# Altium schematic sheet Spindle_Sync.SchDoc: STM32F446 CNC
size B; Author: AM; CompanyName: Expatria Technologies; DrawnBy: A.Marles; Engineer: AM; Organization: Expatria Technolgoies; DocumentNumber: 11; Revision: A1; SheetNumber: 11; SheetTotal: 14
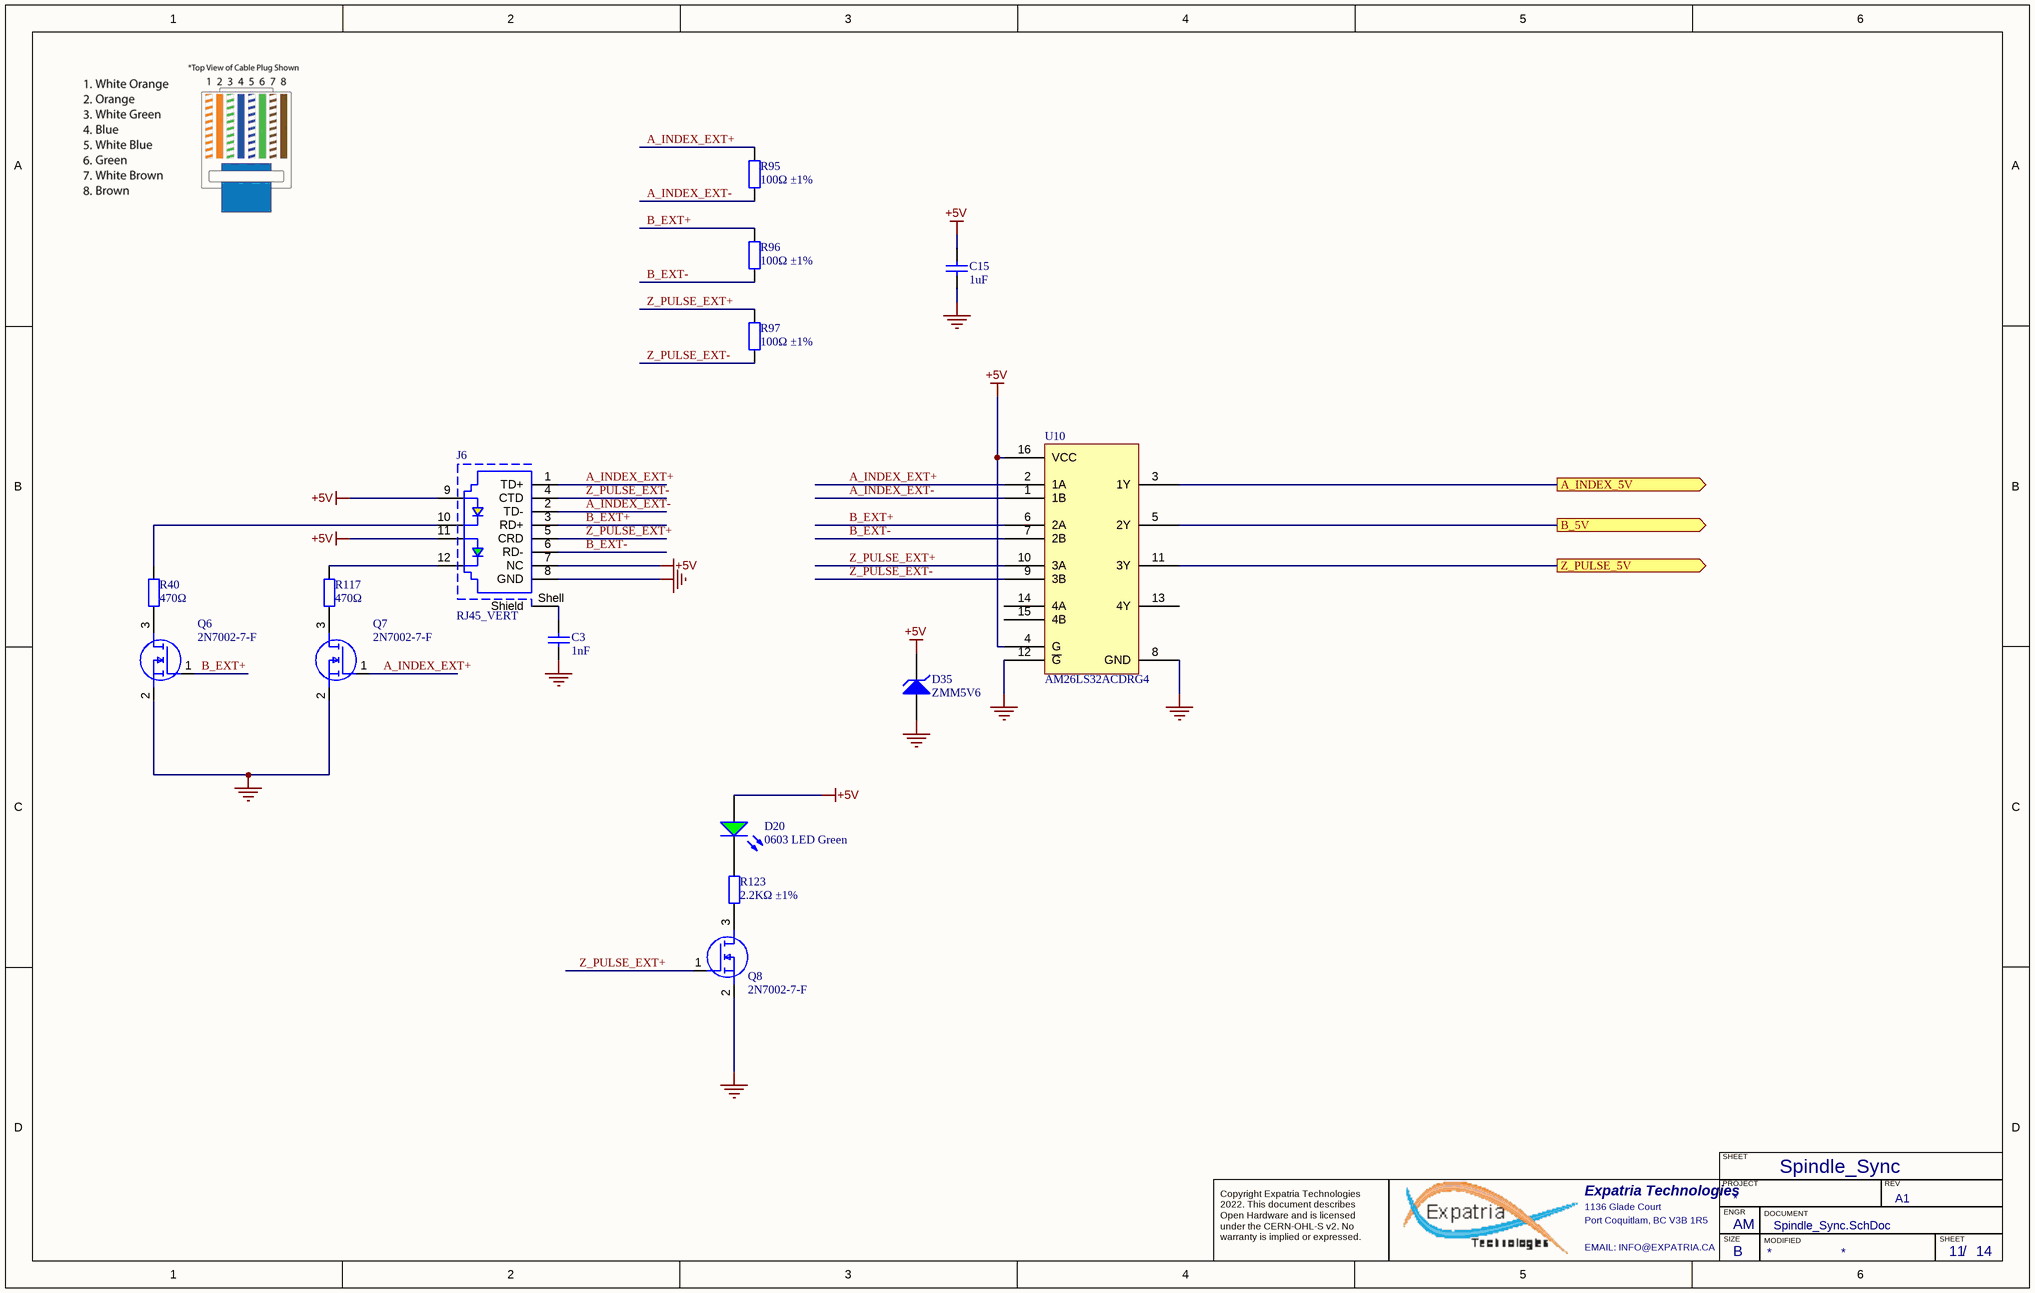
[diagram p0: Spindle_Sync.SchDoc]

## Parts
C3  1nF  [0603_C]
C15  1uF  [0603_C]
D20  0603 LED Green  [0603_LED_S1 - GREEN]
D35  ZMM5V6  [LL-34]
J6  RJ45_VERT  [74990101210]
Q6  2N7002-7-F  [SOT-23(SOT-23-3)]
Q7  2N7002-7-F  [SOT-23(SOT-23-3)]
Q8  2N7002-7-F  [SOT-23(SOT-23-3)]
R40  Resistance: 470Ω  [0402_R]  (hidden comment: 470Ω ±1%)
R95  100Ω ±1%  [0402_R]
R96  100Ω ±1%  [0402_R]
R97  100Ω ±1%  [0402_R]
R117  Resistance: 470Ω  [0402_R]  (hidden comment: 470Ω ±1%)
R123  2.2KΩ ±1%  [0402_R]
U10  AM26LS32ACDRG4  [SOIC-16_150mil]

## Ports
A_INDEX_5V (out), B_5V (out), Z_PULSE_5V (out)

## Nets
+5V: C15.2 D20.A D35.2(K) J6.7(NC) J6.9 J6.11 U10.4(G) U10.16(VCC)
GND: C3.1 C15.1 D35.1(A) J6.8(GND) Q6.2(S) Q7.2(S) Q8.2(S) U10.8(GND) U10.12(~{G})
A_INDEX_5V: U10.3(1Y) ; port A_INDEX_5V
A_INDEX_EXT+: J6.1(TD+) Q7.1(G) R95.2 U10.2(1A)
A_INDEX_EXT-: J6.2(TD-) R95.1 U10.1(1B)
B_5V: U10.5(2Y) ; port B_5V
B_EXT+: J6.3(RD+) Q6.1(G) R96.2 U10.6(2A)
B_EXT-: J6.6(RD-) R96.1 U10.7(2B)
Z_PULSE_5V: U10.11(3Y) ; port Z_PULSE_5V
Z_PULSE_EXT+: J6.5(CRD) Q8.1(G) R97.2 U10.10(3A)
Z_PULSE_EXT-: J6.4(CTD) R97.1 U10.9(3B)
NetC3_2: C3.2 J6.Shell(Shield)
NetD20_K: D20.K R123.2
NetJ6_10: J6.10 R40.2
NetJ6_12: J6.12 R117.2
NetQ6_3: Q6.3(D) R40.1
NetQ7_3: Q7.3(D) R117.1
NetQ8_3: Q8.3(D) R123.1

Not connected (* = marked no-connect by the designer): U10 13(4Y) 14(4A) 15(4B)

## Notes on the sheet
- Spindle_Sync
- SHEET
- Expatria Technologies
- 1136 Glade Court
- Port Coquitlam, BC V3B 1R5
- PROJECT
- SIZE
- ENGR
- MODIFIED
- DOCUMENT
- REV
- Copyright Expatria Technologies 2022. This document describes Open Hardware and is licensed under the CERN-OHL-S v2. No warranty is implied or expressed.
- EMAIL: INFO@EXPATRIA.CA
- B
- /

## Library data of the parts
C3 = 0603 1nF (102) 10% 50V: Chip capacitors; Manufacturer: Samsung Electro-Mechanics; PartNumber: CL10B102KB8NNNC; Tolerance: 10%; Voltage: 50V; ComponentLink1Description: Supplier link; ComponentLink1URL: http://www.szlcsc.com/product/details_1940.html; Package: 0603; Supplier: LC; SuppliersPartNumber: C1588; Capacitance: 1nF
C15 = 0603 1uF (105) 10% 50V: Chip capacitors; Manufacturer: Samsung Electro-Mechanics; PartNumber: CL10A105KB8NNNC; Tolerance: 10%; Voltage: 50V; ComponentLink1Description: Supplier link; ComponentLink1URL: http://www.szlcsc.com/product/details_16531.html; Package: 0603; Supplier: LC; SuppliersPartNumber: C15849; Capacitance: 1uF
D20 = 19-217/GHC-YR1S2/3T: Colorless transparence -40℃~+85℃ 520nm~535nm Emerald 120° 110mW 0603 Light Emitting Diodes (LED) ROHS; Manufacturer: Everlight Elec; Package: 0603; Supplier: LC; SuppliersPartNumber: C72043; Color: Green; Manufacturer Part Number: 19-217/GHC-YR1S2/3T
D35 = LL-34 ZMM5V6: 500mW - 0.1uA @ 1V 5.6V LL-34 Zener Diodes ROHS; ComponentLink1Description: 供应商链接; ComponentLink1URL: http://www.szlcsc.com/product/details_8541.html; Package: LL-34; Supplier: LC; SuppliersPartNumber: C8062
J6 = CMP-00005-1: Telecom and Datacom Connector, 8 Contact(s), Female, Straight, Solder Terminal; SuppliersPartNumber: C386764
Q6-Q8 = 2N7002-7-F: 60V 115mA 7.5Ω@5V,50mA 370mW N Channel SOT-23 MOSFETs ROHS; Manufacturer: Diodes Inc.; SuppliersPartNumber: C85049; Manufacturer Part Number: 2N7002-7-F; Value: 2N7002-7-F; Datasheet Link: https://datasheet.datasheetarchive.com/originals/distributors/SFDatasheet-0/sf-0003625.pdf; Height: 1.2mm; Manufacturer_Part_Number: 2N7002-7-F; Mouser Part Number: 621-2N7002-F; Mouser Price/Stock: https://www.mouser.co.uk/ProductDetail/Diodes-Incorporated/2N7002-7-F?qs=jMXWnm70%252BC%252BAX%252BMLzUkTZg%3D%3D; Arrow Part Number: 2N7002-7-F; Arrow Price/Stock: https://www.arrow.com/en/products/2n7002-7-f/diodes-incorporated?region=nac
R40 R117 = 0402 470R (4700) 1%: Chip resistor; Manufacturer: Uniroyal Elec; PartNumber: 0402WGF4700TCE; Power: 1/16W; Tolerance: 1%; SuppliersPartNumber: C25117; Package: 0402; ComponentLink1URL: http://www.szlcsc.com/product/details_25860.html; ComponentLink1Description: Supplier link; Supplier: LC
R95-R97 = 0402 100R (1000) 1%: Chip resistor; Manufacturer: Uniroyal Elec; PartNumber: 0402WGF1000TCE; Power: 1/16W; ComponentLink1Description: Supplier link; ComponentLink1URL: http://www.szlcsc.com/product/details_25819.html; Package: 0402; Supplier: LC; SuppliersPartNumber: C25076; Resistance: 100Ω; Tolerance: 1%
R123 = 0402 2.2K (2201) 1%: Chip resistor; Manufacturer: Uniroyal Elec; PartNumber: 0402WGF2201TCE; Power: 1/16W; ComponentLink1Description: Supplier link; ComponentLink1URL: http://www.szlcsc.com/product/details_26622.html; Package: 0402; Supplier: LC; SuppliersPartNumber: C25879; Resistance: 2.2KΩ; Tolerance: 1%
U10 = AM26LS32ACDRG4_[C6180]: RS-422 Interface IC Quad Diff Line Rcvr; ComponentLink1Description: 供应商链接; ComponentLink1URL: http://www.szlcsc.com/product/details_6646.html; Package: SOIC-16_150mil; Supplier: LC; SuppliersPartNumber: C6180